# Altium schematic sheet I2C_GPIOs_MIPI-CSI.SchDoc: RK3399 COB Design V1.0
size A3; Author: AVIRAL MISHRA; DocumentNumber: 10; SheetNumber: 10; SheetTotal: 27; PROJECT CODE: A_V1.0
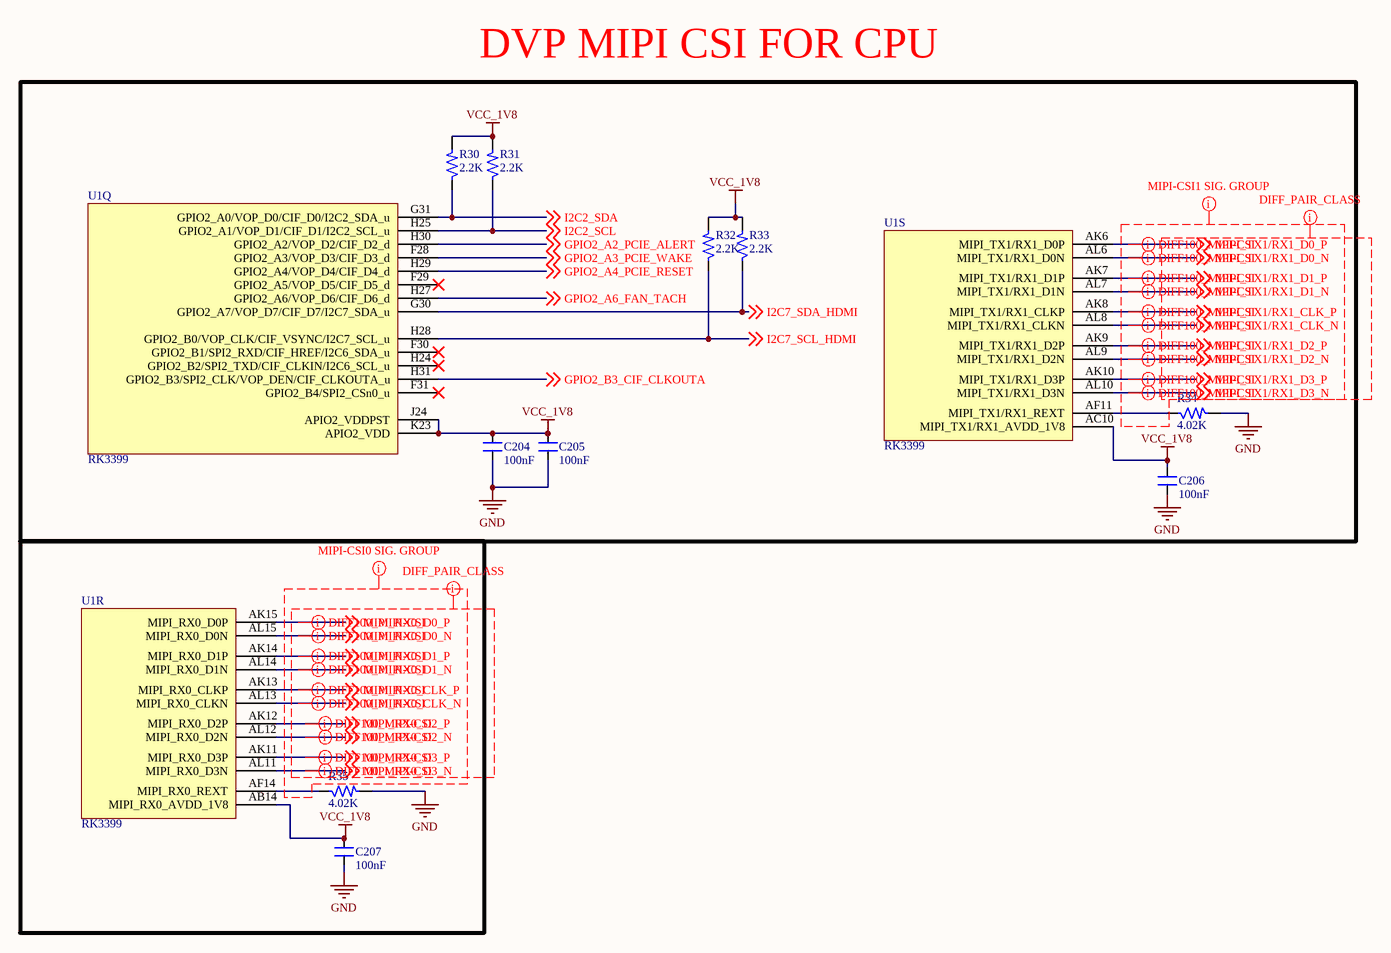
[diagram p0: I2C_GPIOs_MIPI-CSI.SchDoc]

## Parts
C204  100nF  [CAP_0201]
C205  100nF  [CAP_0201]
C206  100nF  [CAP_0201]
C207  100nF  [CAP_0201]
R30  2.2K  [RES_0201]
R31  2.2K  [RES_0201]
R32  2.2K  [RES_0201]
R33  2.2K  [RES_0201]
R34  4.02K  [RES_0201]
R35  4.02K  [RES_0201]
U1  RK3399  [FBGA828_23_826X826]  (parts Q,R,S of 24)

## Blocks framed on the sheet
DVP MIPI CSI FOR CPU: C204-C206 R30-R34 U1

## Nets
GND: C204.1 C205.1 C206.1 C207.1 R34.2 R35.2
VCC_1V8: C204.2 C205.2 C206.2 C207.2 R30.2 R31.2 R32.2 R33.2 U1.AB14(MIPI_RX0_AVDD_1V8) U1.AC10(MIPI_TX1/RX1_AVDD_1V8) U1.J24(APIO2_VDDPST) U1.K23(APIO2_VDD)
GPIO2_A2_PCIE_ALERT: U1.H30(GPIO2_A2/VOP_D2/CIF_D2_d) ; off-sheet GPIO2_A2_PCIE_ALERT
GPIO2_A3_PCIE_WAKE: U1.F28(GPIO2_A3/VOP_D3/CIF_D3_d) ; off-sheet GPIO2_A3_PCIE_WAKE
GPIO2_A4_PCIE_RESET: U1.H29(GPIO2_A4/VOP_D4/CIF_D4_d) ; off-sheet GPIO2_A4_PCIE_RESET
GPIO2_A6_FAN_TACH: U1.H27(GPIO2_A6/VOP_D6/CIF_D6_d) ; off-sheet GPIO2_A6_FAN_TACH
GPIO2_B3_CIF_CLKOUTA: U1.H31(GPIO2_B3/SPI2_CLK/VOP_DEN/CIF_CLKOUTA_u) ; off-sheet GPIO2_B3_CIF_CLKOUTA
I2C2_SCL: R31.1 U1.H25(GPIO2_A1/VOP_D1/CIF_D1/I2C2_SCL_u) ; off-sheet I2C2_SCL
I2C2_SDA: R30.1 U1.G31(GPIO2_A0/VOP_D0/CIF_D0/I2C2_SDA_u) ; off-sheet I2C2_SDA
I2C7_SCL_HDMI: R32.1 U1.H28(GPIO2_B0/VOP_CLK/CIF_VSYNC/I2C7_SCL_u) ; off-sheet I2C7_SCL_HDMI
I2C7_SDA_HDMI: R33.1 U1.G30(GPIO2_A7/VOP_D7/CIF_D7/I2C7_SDA_u) ; off-sheet I2C7_SDA_HDMI
MIPI_RX0_CLK_N: U1.AL13(MIPI_RX0_CLKN) ; off-sheet MIPI_RX0_CLK_N
MIPI_RX0_CLK_P: U1.AK13(MIPI_RX0_CLKP) ; off-sheet MIPI_RX0_CLK_P
MIPI_RX0_D0_N: U1.AL15(MIPI_RX0_D0N) ; off-sheet MIPI_RX0_D0_N
MIPI_RX0_D0_P: U1.AK15(MIPI_RX0_D0P) ; off-sheet MIPI_RX0_D0_P
MIPI_RX0_D1_N: U1.AL14(MIPI_RX0_D1N) ; off-sheet MIPI_RX0_D1_N
MIPI_RX0_D1_P: U1.AK14(MIPI_RX0_D1P) ; off-sheet MIPI_RX0_D1_P
MIPI_RX0_D2_N: U1.AL12(MIPI_RX0_D2N) ; off-sheet MIPI_RX0_D2_N
MIPI_RX0_D2_P: U1.AK12(MIPI_RX0_D2P) ; off-sheet MIPI_RX0_D2_P
MIPI_RX0_D3_N: U1.AL11(MIPI_RX0_D3N) ; off-sheet MIPI_RX0_D3_N
MIPI_RX0_D3_P: U1.AK11(MIPI_RX0_D3P) ; off-sheet MIPI_RX0_D3_P
MIPI_TX1/RX1_CLK_N: U1.AL8(MIPI_TX1/RX1_CLKN) ; off-sheet MIPI_TX1/RX1_CLK_N
MIPI_TX1/RX1_CLK_P: U1.AK8(MIPI_TX1/RX1_CLKP) ; off-sheet MIPI_TX1/RX1_CLK_P
MIPI_TX1/RX1_D0_N: U1.AL6(MIPI_TX1/RX1_D0N) ; off-sheet MIPI_TX1/RX1_D0_N
MIPI_TX1/RX1_D0_P: U1.AK6(MIPI_TX1/RX1_D0P) ; off-sheet MIPI_TX1/RX1_D0_P
MIPI_TX1/RX1_D1_N: U1.AL7(MIPI_TX1/RX1_D1N) ; off-sheet MIPI_TX1/RX1_D1_N
MIPI_TX1/RX1_D1_P: U1.AK7(MIPI_TX1/RX1_D1P) ; off-sheet MIPI_TX1/RX1_D1_P
MIPI_TX1/RX1_D2_N: U1.AL9(MIPI_TX1/RX1_D2N) ; off-sheet MIPI_TX1/RX1_D2_N
MIPI_TX1/RX1_D2_P: U1.AK9(MIPI_TX1/RX1_D2P) ; off-sheet MIPI_TX1/RX1_D2_P
MIPI_TX1/RX1_D3_N: U1.AL10(MIPI_TX1/RX1_D3N) ; off-sheet MIPI_TX1/RX1_D3_N
MIPI_TX1/RX1_D3_P: U1.AK10(MIPI_TX1/RX1_D3P) ; off-sheet MIPI_TX1/RX1_D3_P
NetR34_1: R34.1 U1.AF11(MIPI_TX1/RX1_REXT)
NetR35_1: R35.1 U1.AF14(MIPI_RX0_REXT)

Not connected (* = marked no-connect by the designer): U1 F29(GPIO2_A5/VOP_D5/CIF_D5_d)* F30(GPIO2_B1/SPI2_RXD/CIF_HREF/I2C6_SDA_u)* F31(GPIO2_B4/SPI2_CSn0_u)* H24(GPIO2_B2/SPI2_TXD/CIF_CLKIN/I2C6_SCL_u)*

## Layout directives
differential pair; differential pair class DIFF100_MIPI-CSI: MIPI_RX0_CLK_N, MIPI_RX0_CLK_P, MIPI_RX0_D0_N, MIPI_RX0_D0_P, MIPI_RX0_D1_N, MIPI_RX0_D1_P, MIPI_RX0_D2_N, MIPI_RX0_D2_P, MIPI_RX0_D3_N, MIPI_RX0_D3_P, MIPI_TX1/RX1_CLK_N, MIPI_TX1/RX1_CLK_P, MIPI_TX1/RX1_D0_N, MIPI_TX1/RX1_D0_P, MIPI_TX1/RX1_D1_N, MIPI_TX1/RX1_D1_P, MIPI_TX1/RX1_D2_N, MIPI_TX1/RX1_D2_P, MIPI_TX1/RX1_D3_N, MIPI_TX1/RX1_D3_P
net class MIPI-CSI0 SIG. GROUP: MIPI_RX0_CLK_N, MIPI_RX0_CLK_P, MIPI_RX0_D0_N, MIPI_RX0_D0_P, MIPI_RX0_D1_N, MIPI_RX0_D1_P, MIPI_RX0_D2_N, MIPI_RX0_D2_P, MIPI_RX0_D3_N, MIPI_RX0_D3_P
mark named MIPI-CSI1 SIG. GROUP: MIPI_TX1/RX1_CLK_N, MIPI_TX1/RX1_CLK_P, MIPI_TX1/RX1_D0_N, MIPI_TX1/RX1_D0_P, MIPI_TX1/RX1_D1_N, MIPI_TX1/RX1_D1_P, MIPI_TX1/RX1_D2_N, MIPI_TX1/RX1_D2_P, MIPI_TX1/RX1_D3_N, MIPI_TX1/RX1_D3_P
net class DIFF_PAIR_CLASS: MIPI_RX0_CLK_N, MIPI_RX0_CLK_P, MIPI_RX0_D0_N, MIPI_RX0_D0_P, MIPI_RX0_D1_N, MIPI_RX0_D1_P, MIPI_RX0_D2_N, MIPI_RX0_D2_P, MIPI_RX0_D3_N, MIPI_RX0_D3_P, MIPI_TX1/RX1_CLK_N, MIPI_TX1/RX1_CLK_P, MIPI_TX1/RX1_D0_N, MIPI_TX1/RX1_D0_P, MIPI_TX1/RX1_D1_N, MIPI_TX1/RX1_D1_P, MIPI_TX1/RX1_D2_N, MIPI_TX1/RX1_D2_P, MIPI_TX1/RX1_D3_N, MIPI_TX1/RX1_D3_P

## Notes on the sheet
- TITLE:
- DOCUMENT NAME:
- SCALE 1:1
- This document is copyright of EsteemPCB and shall not be revealed, produced, copied, in whole or in part, nor
- PROJECT CODE:
- TEMPLATE:
- A4
- AUTHOR:
- Sheet
- of
- used for any purpose other than submitted.

## Library data of the parts
C204-C207 = CAP_100nF-25V-10%-0201: 0.1µF ±10% 25V Ceramic Capacitor X5R 0201 (0603 Metric) /; Manufacturer: TDK Corporation; Manufacturer Part Number: C0603X5R1E104K030BB; Case/Package: 0201; Supplier-1: Digikey
R30-R33 = RES_2.2K-0.05W-1%-0201: 2.2 kOhms ±1% 0.05W, 1/20W Chip Resistor 0201 (0603 Metric) Thick Film /; Manufacturer: Stackpole Electronics Inc; Manufacturer Part Number: RMCF0201FT2K20; Case/Package: 0201; Supplier-1: Digikey
R34 R35 = RES_4.02K-0.05W-1%-0201: 4.02 kOhms ±1% 0.05W, 1/20W Chip Resistor 0201 (0603 Metric) Thick Film /; Manufacturer: Yageo; Manufacturer Part Number: RC0201FR-074K02L; Case/Package: 0201; Supplier-1: Digikey
U1 = IC_RK3399-FCBGA828: RK3399 is a low power, high performance processor for computing, personal mobile.; Manufacturer: Rockchip; Manufacturer Part Number: RK3399; Case/Package: FCBGA828; Supplier-1: Rockchip